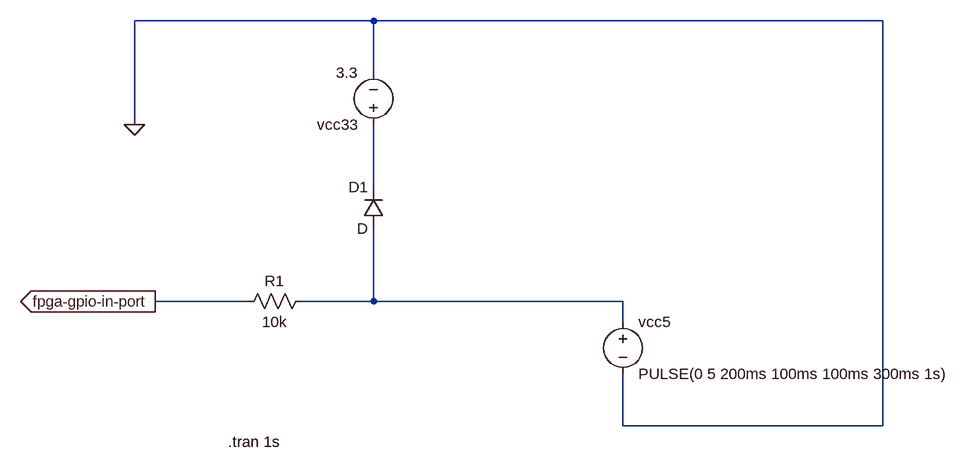
[diagram p0: schematic bread-board-5to33-test04.asc]
bread-board-5to33-test04.asc, the LTspice schematic file:
Version 4
SHEET 1 1052 712
WIRE -96 -224 -464 -224
WIRE 688 -224 -96 -224
WIRE -96 -144 -96 -224
WIRE -464 -64 -464 -224
WIRE -96 32 -96 -64
WIRE -288 208 -432 208
WIRE -96 208 -96 96
WIRE -96 208 -208 208
WIRE 288 208 -96 208
WIRE 288 240 288 208
WIRE 288 400 288 320
WIRE 688 400 688 -224
WIRE 688 400 288 400
FLAG -432 208 fpga-gpio-in-port
IOPIN -432 208 Out
FLAG -464 -64 0
SYMBOL voltage 288 224 R0
WINDOW 123 0 0 Left 2
WINDOW 39 0 0 Left 2
SYMATTR InstName vcc5
SYMATTR Value PULSE(0 5 200ms 100ms 100ms 300ms 1s)
SYMBOL voltage -96 -48 R180
WINDOW 123 0 0 Left 2
WINDOW 39 0 0 Left 2
SYMATTR InstName vcc33
SYMATTR Value 3.3
SYMBOL res -192 192 R90
WINDOW 0 0 56 VBottom 2
WINDOW 3 32 56 VTop 2
SYMATTR InstName R1
SYMATTR Value 10k
SYMBOL diode -80 96 R180
WINDOW 0 24 64 Left 2
WINDOW 3 24 0 Left 2
SYMATTR InstName D1
TEXT -320 424 Left 2 !.tran 1s

The netlist it stands for:
* bread-board-5to33-test04.asc
vcc5 N002 0 PULSE(0 5 200ms 100ms 100ms 300ms 1s)
vcc33 N001 0 3.3
R1 N002 fpga-gpio-in-port 10k
D1 N002 N001 D
.model D D
.lib standard.dio
.tran 1s
.backanno
.end